# Altium schematic sheet Sheet1.SchDoc
size A0
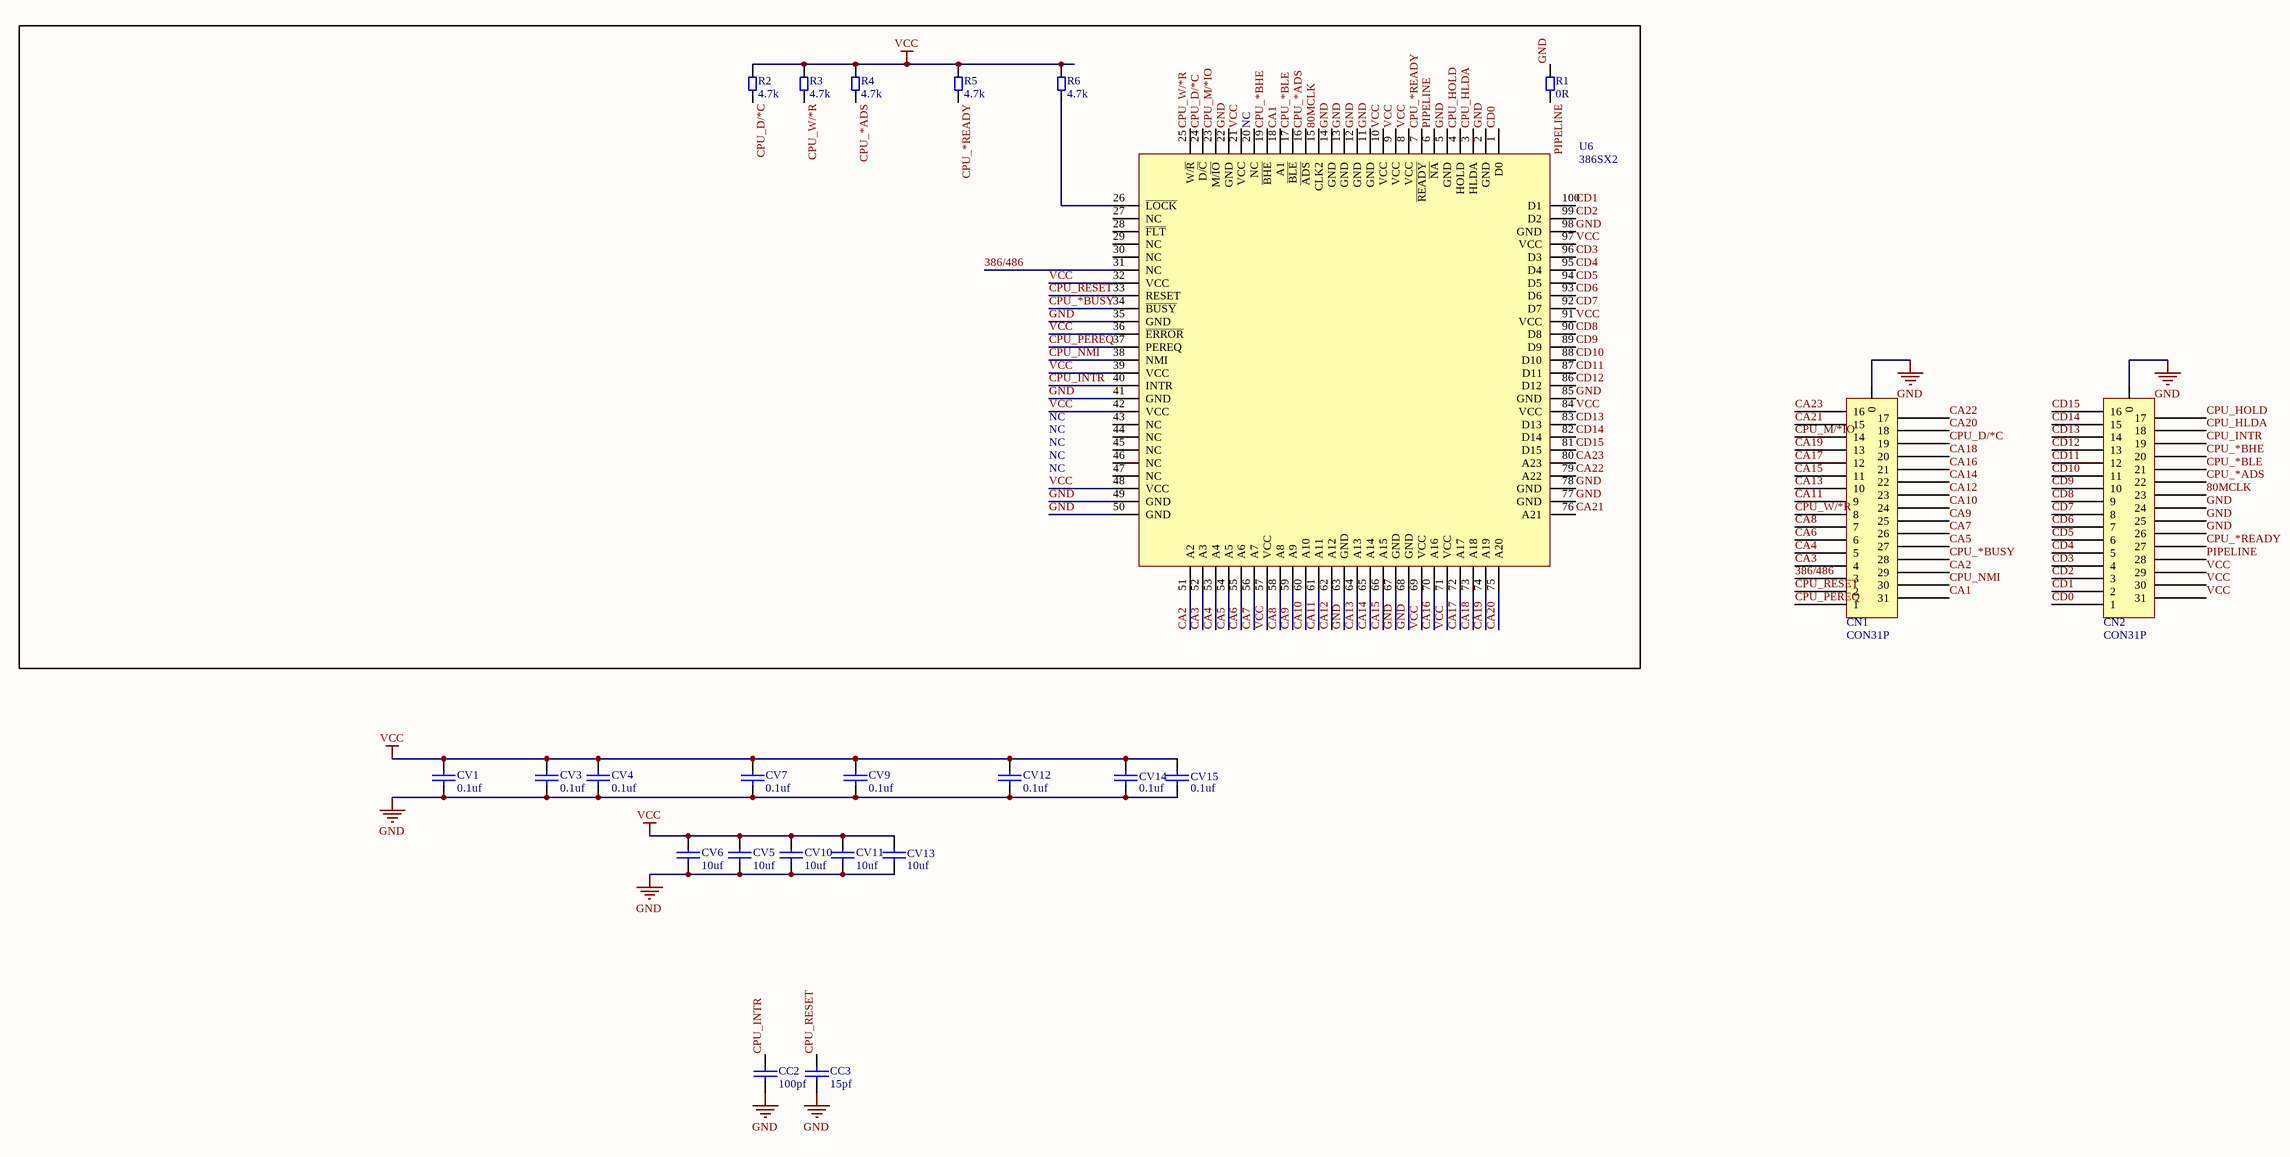
[diagram p0: Sheet1.SchDoc]

## Parts
CC2  100pf  [C0603]
CC3  15pf  [C0603]
CN1  CON31P  [BTB1.0-31P-B]
CN2  CON31P  [BTB1.0-31P-B]
CV1  0.1uf  [C0603]
CV3  0.1uf  [C0603]
CV4  0.1uf  [C0603]
CV5  10uf  [C0603]
CV6  10uf  [C0603]
CV7  0.1uf  [C0603]
CV9  0.1uf  [C0603]
CV10  10uf  [C0603]
CV11  10uf  [C0603]
CV12  0.1uf  [C0603]
CV13  10uf  [C0603]
CV14  0.1uf  [C0603]
CV15  0.1uf  [C0603]
R1  0R  [R0603]
R2  4.7k  [R0603]
R3  4.7k  [R0603]
R4  4.7k  [R0603]
R5  4.7k  [R0603]
R6  4.7k  [R0603]
U6  386SX2  [PQFP100A]

## Nets
GND: CC2.2 CC3.2 CN1.0 CN2.0 CN2.24 CN2.25 CN2.26 CV1.2 CV3.2 CV4.2 CV5.2 CV6.2 CV7.2 CV9.2 CV10.2 CV11.2 CV12.2 CV13.2 CV14.2 CV15.2 R1.2 U6.2(GND) U6.5(GND) U6.11(GND) U6.12(GND) U6.13(GND) U6.14(GND) U6.22(GND) U6.35(GND) U6.41(GND) U6.49(GND) U6.50(GND) U6.63(GND) U6.67(GND) U6.68(GND) U6.77(GND) U6.78(GND) U6.85(GND) U6.98(GND)
VCC: CN2.29 CN2.30 CN2.31 CV1.1 CV3.1 CV4.1 CV5.1 CV6.1 CV7.1 CV9.1 CV10.1 CV11.1 CV12.1 CV13.1 CV14.1 CV15.1 R2.2 R3.2 R4.2 R5.2 R6.2 U6.8(VCC) U6.9(VCC) U6.10(VCC) U6.21(VCC) U6.32(VCC) U6.36(~{ERROR}) U6.39(VCC) U6.42(VCC) U6.48(VCC) U6.57(VCC) U6.69(VCC) U6.71(VCC) U6.84(VCC) U6.91(VCC) U6.97(VCC)
80MCLK: CN2.23 U6.15(CLK2)
386/486: CN1.3 U6.31(NC)
CA1: CN1.31 U6.18(A1)
CA2: CN1.29 U6.51(A2)
CA3: CN1.4 U6.52(A3)
CA4: CN1.5 U6.53(A4)
CA5: CN1.27 U6.54(A5)
CA6: CN1.6 U6.55(A6)
CA7: CN1.26 U6.56(A7)
CA8: CN1.7 U6.58(A8)
CA9: CN1.25 U6.59(A9)
CA10: CN1.24 U6.60(A10)
CA11: CN1.9 U6.61(A11)
CA12: CN1.23 U6.62(A12)
CA13: CN1.10 U6.64(A13)
CA14: CN1.22 U6.65(A14)
CA15: CN1.11 U6.66(A15)
CA16: CN1.21 U6.70(A16)
CA17: CN1.12 U6.72(A17)
CA18: CN1.20 U6.73(A18)
CA19: CN1.13 U6.74(A19)
CA20: CN1.18 U6.75(A20)
CA21: CN1.15 U6.76(A21)
CA22: CN1.17 U6.79(A22)
CA23: CN1.16 U6.80(A23)
CD0: CN2.1 U6.1(D0)
CD1: CN2.2 U6.100(D1)
CD2: CN2.3 U6.99(D2)
CD3: CN2.4 U6.96(D3)
CD4: CN2.5 U6.95(D4)
CD5: CN2.6 U6.94(D5)
CD6: CN2.7 U6.93(D6)
CD7: CN2.8 U6.92(D7)
CD8: CN2.9 U6.90(D8)
CD9: CN2.10 U6.89(D9)
CD10: CN2.11 U6.88(D10)
CD11: CN2.12 U6.87(D11)
CD12: CN2.13 U6.86(D12)
CD13: CN2.14 U6.83(D13)
CD14: CN2.15 U6.82(D14)
CD15: CN2.16 U6.81(D15)
CPU_*ADS: CN2.22 R4.1 U6.16(~{ADS})
CPU_*BHE: CN2.20 U6.19(~{BHE})
CPU_*BLE: CN2.21 U6.17(~{BLE})
CPU_*BUSY: CN1.28 U6.34(~{BUSY})
CPU_*READY: CN2.27 R5.1 U6.7(~{READY})
CPU_D/*C: CN1.19 R2.1 U6.24(D/~{C})
CPU_HLDA: CN2.18 U6.3(HLDA)
CPU_HOLD: CN2.17 U6.4(HOLD)
CPU_INTR: CC2.1 CN2.19 U6.40(INTR)
CPU_M/*IO: CN1.14 U6.23(M/~{IO})
CPU_NMI: CN1.30 U6.38(NMI)
CPU_PEREQ: CN1.1 U6.37(PEREQ)
CPU_RESET: CC3.1 CN1.2 U6.33(RESET)
CPU_W/*R: CN1.8 R3.1 U6.25(W/~{R})
PIPELINE: CN2.28 R1.1 U6.6(~{NA})
NetR6_1: R6.1 U6.26(~{LOCK})

Not connected (* = marked no-connect by the designer): U6 20(NC) 27(NC) 28(~{FLT}) 29(NC) 30(NC) 43(NC) 44(NC) 45(NC) 46(NC) 47(NC)

## Notes on the sheet
- (near U6) NC
- NC

## Library data of the parts
CC2 CC3 CV1 CV3-CV7 CV9-CV15 = CAP
R1-R6 = RES2